# EAGLE design calchack (EAGLE 6.4)
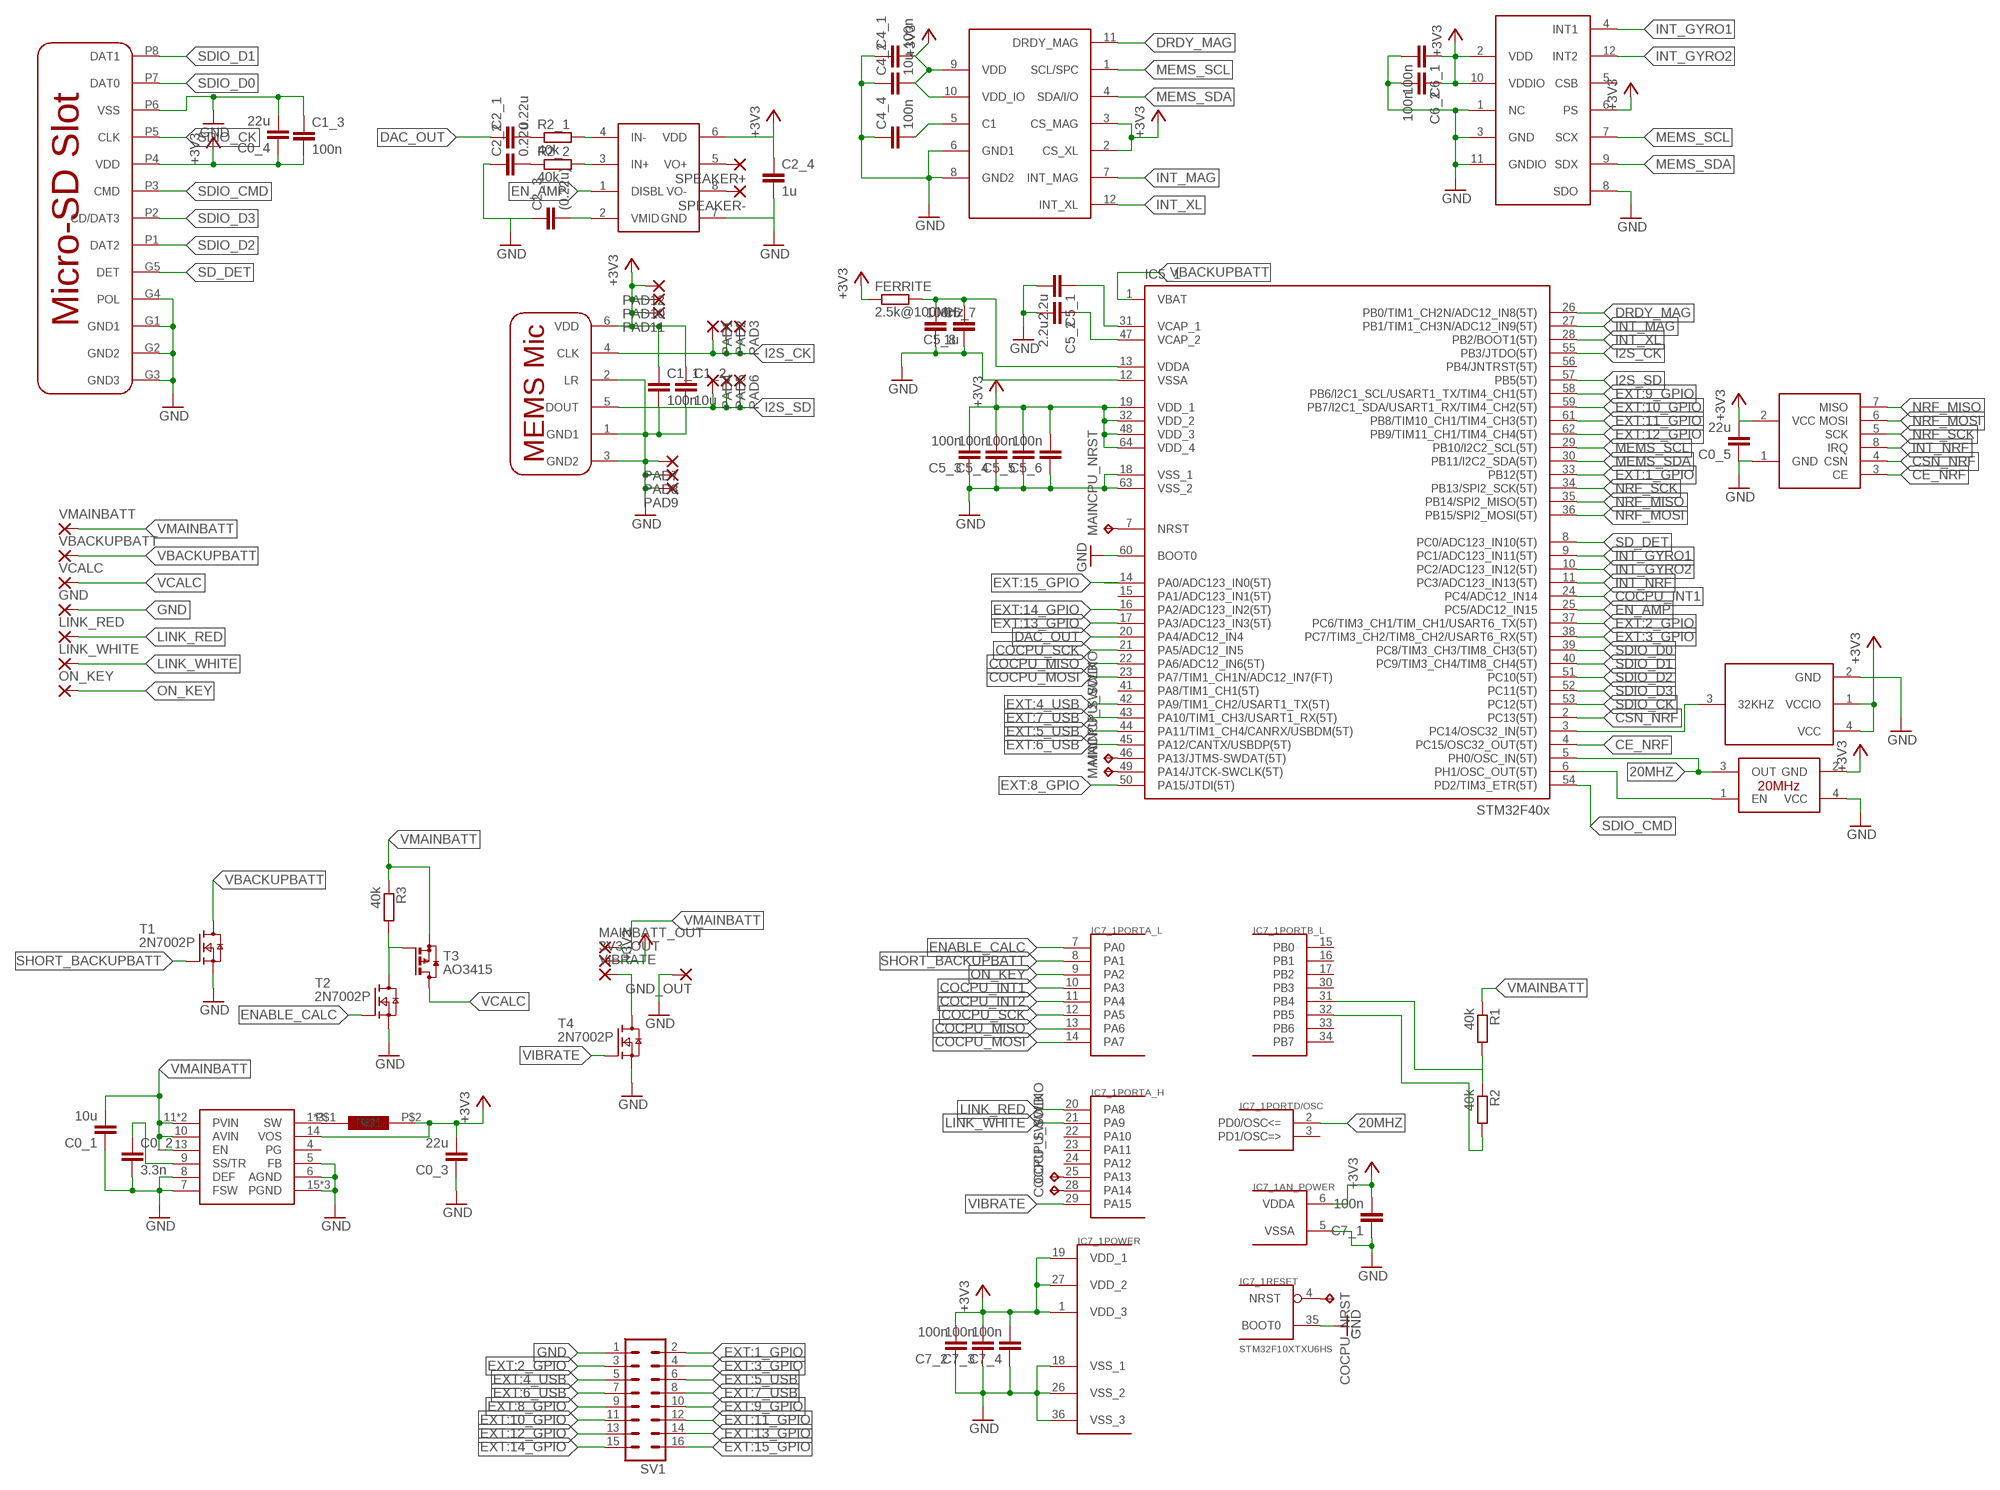
[diagram p0: schematic, sheet 1]

## Parts
3V3_OUT  1,6/0,8  [1,6/0,8]
C0_1  10u  C-EUC0805  [C0805]
C0_2  3.3n  C-EUC0603  [C0603]
C0_3  22u  C-EUC0805  [C0805]
C0_4  22u  C-EUC0805  [C0805]
C0_5  22u  C-EUC0805  [C0805]
C1_1  100n  C-EUC0603  [C0603]
C1_2  10u  C-EUC0603  [C0603]
C1_3  100n  C-EUC0603  [C0603]
C2_1  0.22u  C-EUC0603  [C0603]
C2_2  0.22u  C-EUC0603  [C0603]
C2_3  (0.22u)  C-EUC0603  [C0603]
C2_4  1u  C-EUC0603  [C0603]
C4_1  100n  C-EUC0603  [C0603]
C4_2  10u  C-EUC0603  [C0603]
C4_4  100n  C-EUC0603  [C0603]
C5_1  2.2u  C-EUC0603  [C0603]
C5_2  2.2u  C-EUC0603  [C0603]
C5_3  100n  C-EUC0603  [C0603]
C5_4  100n  C-EUC0603  [C0603]
C5_5  100n  C-EUC0603  [C0603]
C5_6  100n  C-EUC0603  [C0603]
C5_7  1u  C-EUC0603  [C0603]
C5_8  100n  C-EUC0603  [C0603]
C6_1  100n  C-EUC0603  [C0603]
C6_2  100n  C-EUC0603  [C0603]
C7_1  100n  C-EUC0603  [C0603]
C7_2  100n  C-EUC0603  [C0603]
C7_3  100n  C-EUC0603  [C0603]
C7_4  100n  C-EUC0603  [C0603]
COCPU_NRST  TPTP10SQ  [TP10SQ]
COCPU_SWCLK  TPTP10SQ  [TP10SQ]
COCPU_SWDIO  TPTP10SQ  [TP10SQ]
FERRITE  2.5k@100MHz  R-EU_R0603  [R0603]
GND  1,6/0,8  [1,6/0,8]
GND_OUT  1,6/0,8  [1,6/0,8]
IC0_1  TPS62142  [TPS62142]
IC1_1  MP45DT02  [MP45DT02]
IC2_1  TPA6211A1  [TPA6211A1]
IC3_1  475710001  [475710001]
IC4_1  LSM303C  [LSM303C]
IC5_1  STM32F405R  [TQFP64]
IC6_1  BMG160  [BMG160]
IC7_1  STM32F10XTXU6HS  [VFQFPN36-HS]
L0_1  IHLP1212BZER2R2M11  [IHLP1212BZER2R2M11]
LINK_RED  1,6/0,8  [1,6/0,8]
LINK_WHITE  1,6/0,8  [1,6/0,8]
MAINBATT_OUT  1,6/0,8  [1,6/0,8]
MAINCPU_NRST  TPTP10SQ  [TP10SQ]
MAINCPU_SWCLK  TPTP10SQ  [TP10SQ]
MAINCPU_SWDIO  TPTP10SQ  [TP10SQ]
NRF24L01  NRF24L01  [NRF24L01]
ON_KEY  1,6/0,8  [1,6/0,8]
OSC5_1  SG-3030JC  [SG-3030JC]
PAD1  1,6/0,8  [1,6/0,8]
PAD2  1,6/0,8  [1,6/0,8]
PAD3  1,6/0,8  [1,6/0,8]
PAD4  1,6/0,8  [1,6/0,8]
PAD5  1,6/0,8  [1,6/0,8]
PAD6  1,6/0,8  [1,6/0,8]
PAD7  1,6/0,8  [1,6/0,8]
PAD8  1,6/0,8  [1,6/0,8]
PAD9  1,6/0,8  [1,6/0,8]
PAD10  1,6/0,8  [1,6/0,8]
PAD11  1,6/0,8  [1,6/0,8]
PAD12  1,6/0,8  [1,6/0,8]
R1  40k  R-EU_R0603  [R0603]
R2  40k  R-EU_R0603  [R0603]
R2_1  40k  R-EU_R0603  [R0603]
R2_2  40k  R-EU_R0603  [R0603]
R3  40k  R-EU_R0603  [R0603]
SPEAKER+  1,6/0,8  [1,6/0,8]
SPEAKER-  1,6/0,8  [1,6/0,8]
SV1  MA08-2  [MA08-2]
T1  2N7002P  [SOT23]
T2  2N7002P  [SOT23]
T3  AO3415  [AO3415]
T4  2N7002P  [SOT23]
U$1  ASDMB-20.000MHZ-LC-T  [ASDMB-20.000MHZ-LC-T]
VBACKUPBATT  1,6/0,8  [1,6/0,8]
VCALC  1,6/0,8  [1,6/0,8]
VIBRATE  1,6/0,8  [1,6/0,8]
VMAINBATT  1,6/0,8  [1,6/0,8]

## Nets
20MHZ: IC5_1.5(PH0/OSC_IN(5T)) IC7_1.2(PORTD/OSC:PD0/OSC<=) U$1.3(OUT)
+3V3: 3V3_OUT.1(P) C0_3.2 C0_4.1 C0_5.2 C1_1.1 C1_2.1 C1_3.2 C2_4.1 C4_1.2 C4_2.2 C5_3.2 C5_4.2 C5_5.2 C5_6.2 C6_1.1 C6_2.1 C7_1.2 C7_2.2 C7_3.2 C7_4.2 FERRITE.1 IC0_1.14(VOS) IC1_1.6(VDD) IC2_1.6(VDD) IC3_1.P4(VDD) IC4_1.2(CS_XL) IC4_1.3(CS_MAG) IC4_1.9(VDD) IC4_1.10(VDD_IO) IC5_1.19(VDD_1) IC5_1.32(VDD_2) IC5_1.48(VDD_3) IC5_1.64(VDD_4) IC6_1.2(VDD) IC6_1.6(PS) IC6_1.10(VDDIO) IC7_1.1(POWER:VDD_3) IC7_1.6(AN_POWER:VDDA) IC7_1.19(POWER:VDD_1) IC7_1.27(POWER:VDD_2) L0_1.P$2 NRF24L01.2(VCC) OSC5_1.1(VCCIO) OSC5_1.4(VCC) PAD10.1(P) PAD11.1(P) PAD12.1(P) U$1.2(GND)
CE_NRF: IC5_1.4(PC15/OSC32_OUT(5T)) NRF24L01.3(CE)
COCPU_INT1: IC5_1.24(PC4/ADC12_IN14) IC7_1.10(PORTA_L:PA3)
COCPU_INT2: IC7_1.11(PORTA_L:PA4)
COCPU_MISO: IC5_1.22(PA6/ADC12_IN6(5T)) IC7_1.13(PORTA_L:PA6)
COCPU_MOSI: IC5_1.23(PA7/TIM1_CH1N/ADC12_IN7(FT)) IC7_1.14(PORTA_L:PA7)
COCPU_SCK: IC5_1.21(PA5/ADC12_IN5) IC7_1.12(PORTA_L:PA5)
CSN_NRF: IC5_1.2(PC13(5T)) NRF24L01.4(CSN)
DAC_OUT: C2_1.1 IC5_1.20(PA4/ADC12_IN4)
DRDY_MAG: IC4_1.11(DRDY_MAG) IC5_1.26(PB0/TIM1_CH2N/ADC12_IN8(5T))
EN_AMP: IC2_1.1(DISBL) IC5_1.25(PC5/ADC12_IN15)
ENABLE_CALC: IC7_1.7(PORTA_L:PA0) T2.1(G)
EXT:1_GPIO: IC5_1.33(PB12(5T)) SV1.2
EXT:2_GPIO: IC5_1.37(PC6/TIM3_CH1/TIM_CH1/USART6_TX(5T)) SV1.3
EXT:3_GPIO: IC5_1.38(PC7/TIM3_CH2/TIM8_CH2/USART6_RX(5T)) SV1.4
EXT:4_USB: IC5_1.42(PA9/TIM1_CH2/USART1_TX(5T)) SV1.5
EXT:5_USB: IC5_1.44(PA11/TIM1_CH4/CANRX/USBDM(5T)) SV1.6
EXT:6_USB: IC5_1.45(PA12/CANTX/USBDP(5T)) SV1.7
EXT:7_USB: IC5_1.43(PA10/TIM1_CH3/USART1_RX(5T)) SV1.8
EXT:8_GPIO: IC5_1.50(PA15/JTDI(5T)) SV1.9
EXT:9_GPIO: IC5_1.58(PB6/I2C1_SCL/USART1_TX/TIM4_CH1(5T)) SV1.10
EXT:10_GPIO: IC5_1.59(PB7/I2C1_SDA/USART1_RX/TIM4_CH2(5T)) SV1.11
EXT:11_GPIO: IC5_1.61(PB8/TIM10_CH1/TIM4_CH3(5T)) SV1.12
EXT:12_GPIO: IC5_1.62(PB9/TIM11_CH1/TIM4_CH4(5T)) SV1.13
EXT:13_GPIO: IC5_1.17(PA3/ADC123_IN3(5T)) SV1.14
EXT:14_GPIO: IC5_1.16(PA2/ADC123_IN2(5T)) SV1.15
EXT:15_GPIO: IC5_1.14(PA0/ADC123_IN0(5T)) SV1.16
GND: C0_1.1 C0_2.2 C0_3.1 C0_4.2 C0_5.1 C1_1.2 C1_2.2 C1_3.1 C2_2.1 C2_3.1 C2_4.2 C4_1.1 C4_2.1 C4_4.1 C5_1.2 C5_2.2 C5_3.1 C5_4.1 C5_5.1 C5_6.1 C5_7.2 C5_8.1 C6_1.2 C6_2.2 C7_1.1 C7_2.1 C7_3.1 C7_4.1 GND.1(P) GND_OUT.1(P) IC0_1.5(FB) IC0_1.6(AGND) IC0_1.7(FSW) IC0_1.8(DEF) IC0_1.15(PGND) IC0_1.16(PGND) IC0_1.TH(PGND) IC1_1.1(GND1) IC1_1.2(LR) IC1_1.3(GND2) IC2_1.7(GND) IC3_1.G1(GND1) IC3_1.G2(GND2) IC3_1.G3(GND3) IC3_1.G4(POL) IC3_1.P6(VSS) IC4_1.6(GND1) IC4_1.8(GND2) IC5_1.12(VSSA) IC5_1.18(VSS_1) IC5_1.60(BOOT0) IC5_1.63(VSS_2) IC6_1.1(NC) IC6_1.3(GND) IC6_1.8(SDO) IC6_1.11(GNDIO) IC7_1.5(AN_POWER:VSSA) IC7_1.18(POWER:VSS_1) IC7_1.26(POWER:VSS_2) IC7_1.35(RESET:BOOT0) IC7_1.36(POWER:VSS_3) NRF24L01.1(GND) OSC5_1.2(GND) PAD7.1(P) PAD8.1(P) PAD9.1(P) SV1.1 T1.2(S) T2.2(S) T4.2(S) U$1.4(VCC)
I2S_CK: IC1_1.4(CLK) IC5_1.55(PB3/JTDO(5T)) PAD1.1(P) PAD2.1(P) PAD3.1(P)
I2S_SD: IC1_1.5(DOUT) IC5_1.57(PB5(5T)) PAD4.1(P) PAD5.1(P) PAD6.1(P)
INT_GYRO1: IC5_1.9(PC1/ADC123_IN11(5T)) IC6_1.4(INT1)
INT_GYRO2: IC5_1.10(PC2/ADC123_IN12(5T)) IC6_1.12(INT2)
INT_MAG: IC4_1.7(INT_MAG) IC5_1.27(PB1/TIM1_CH3N/ADC12_IN9(5T))
INT_NRF: IC5_1.11(PC3/ADC123_IN13(5T)) NRF24L01.8(IRQ)
INT_XL: IC4_1.12(INT_XL) IC5_1.28(PB2/BOOT1(5T))
LINK_RED: IC7_1.20(PORTA_H:PA8) LINK_RED.1(P)
LINK_WHITE: IC7_1.21(PORTA_H:PA9) LINK_WHITE.1(P)
MEMS_SCL: IC4_1.1(SCL/SPC) IC5_1.29(PB10/I2C2_SCL(5T)) IC6_1.7(SCX)
MEMS_SDA: IC4_1.4(SDA/I/O) IC5_1.30(PB11/I2C2_SDA(5T)) IC6_1.9(SDX)
N$1: IC2_1.3(IN+) R2_2.2
N$2: IC2_1.4(IN-) R2_1.2
N$3: C2_1.2 R2_1.1
N$4: C2_2.2 R2_2.1
N$5: C2_3.2 IC2_1.2(VMID)
N$6: IC5_1.6(PH1/OSC_OUT(5T)) U$1.1(EN)
N$7: C4_4.2 IC4_1.5(C1)
N$8: C5_7.1 C5_8.2 FERRITE.2 IC5_1.13(VDDA)
N$9: COCPU_SWDIO.TP IC7_1.25(PORTA_H:PA13)
N$10: C0_2.1 IC0_1.9(SS/TR)
N$11: IC2_1.5(VO+) SPEAKER+.1(P)
N$12: C5_2.1 IC5_1.47(VCAP_2)
N$13: C5_1.1 IC5_1.31(VCAP_1)
N$14: IC2_1.8(VO-) SPEAKER-.1(P)
N$15: IC0_1.1(SW) IC0_1.2(SW) IC0_1.3(SW) L0_1.P$1
N$16: R3.2 T2.3(D) T3.1(G)
N$17: COCPU_NRST.TP IC7_1.4(RESET:NRST)
N$18: T4.3(D) VIBRATE.1(P)
N$19: COCPU_SWCLK.TP IC7_1.28(PORTA_H:PA14)
N$20: IC5_1.49(PA14/JTCK-SWCLK(5T)) MAINCPU_SWCLK.TP
N$21: IC5_1.46(PA13/JTMS-SWDAT(5T)) MAINCPU_SWDIO.TP
N$22: IC5_1.3(PC14/OSC32_IN(5T)) OSC5_1.3(32KHZ)
N$23: IC5_1.7(NRST) MAINCPU_NRST.TP
N$24: IC7_1.31(PORTB_L:PB4) R1.2 R2.1
N$25: IC7_1.32(PORTB_L:PB5) R2.2
NRF_MISO: IC5_1.35(PB14/SPI2_MISO(5T)) NRF24L01.7(MISO)
NRF_MOSI: IC5_1.36(PB15/SPI2_MOSI(5T)) NRF24L01.6(MOSI)
NRF_SCK: IC5_1.34(PB13/SPI2_SCK(5T)) NRF24L01.5(SCK)
ON_KEY: IC7_1.9(PORTA_L:PA2) ON_KEY.1(P)
SD_DET: IC3_1.G5(DET) IC5_1.8(PC0/ADC123_IN10(5T))
SDIO_CK: IC3_1.P5(CLK) IC5_1.53(PC12(5T))
SDIO_CMD: IC3_1.P3(CMD) IC5_1.54(PD2/TIM3_ETR(5T))
SDIO_D0: IC3_1.P7(DAT0) IC5_1.39(PC8/TIM3_CH3/TIM8_CH3(5T))
SDIO_D1: IC3_1.P8(DAT1) IC5_1.40(PC9/TIM3_CH4/TIM8_CH4(5T))
SDIO_D2: IC3_1.P1(DAT2) IC5_1.51(PC10(5T))
SDIO_D3: IC3_1.P2(CD/DAT3) IC5_1.52(PC11(5T))
SHORT_BACKUPBATT: IC7_1.8(PORTA_L:PA1) T1.1(G)
VBACKUPBATT: IC5_1.1(VBAT) T1.3(D) VBACKUPBATT.1(P)
VCALC: T3.3(D) VCALC.1(P)
VIBRATE: IC7_1.29(PORTA_H:PA15) T4.1(G)
VMAINBATT: C0_1.2 IC0_1.10(AVIN) IC0_1.11(PVIN) IC0_1.12(PVIN) IC0_1.13(EN) MAINBATT_OUT.1(P) R1.1 R3.1 T3.2(S) VMAINBATT.1(P)
Unconnected: IC0_1.4(PG) IC5_1.15(PA1/ADC123_IN1(5T)) IC5_1.41(PA8/TIM1_CH1(5T)) IC5_1.56(PB4/JNTRST(5T)) IC6_1.5(CSB) IC7_1.3(PORTD/OSC:PD1/OSC=>) IC7_1.15(PORTB_L:PB0) IC7_1.16(PORTB_L:PB1) IC7_1.17(PORTB_L:PB2) IC7_1.22(PORTA_H:PA10) IC7_1.23(PORTA_H:PA11) IC7_1.24(PORTA_H:PA12) IC7_1.30(PORTB_L:PB3) IC7_1.33(PORTB_L:PB6) IC7_1.34(PORTB_L:PB7)

## Library data of the parts
3V3_OUT GND GND_OUT LINK_RED LINK_WHITE MAINBATT_OUT ON_KEY PAD1-PAD12 SPEAKER+ SPEAKER- VBACKUPBATT VCALC VIBRATE VMAINBATT = wirepad:1,6/0,8: THROUGH-HOLE PAD
C0_1-C0_5 C1_1-C1_3 C2_1-C2_4 C4_1 C4_2 C4_4 C5_1-C5_8 C6_1 C6_2 C7_1-C7_4 = rcl:C-EU: CAPACITOR, European symbol
COCPU_NRST COCPU_SWCLK COCPU_SWDIO MAINCPU_NRST MAINCPU_SWCLK MAINCPU_SWDIO = testpad:TP: Test pad
FERRITE R1 R2 R2_1 R2_2 R3 = rcl:R-EU_: RESISTOR, European symbol
IC0_1 = calchack:TPS62142
IC1_1 = calchack:MP45DT02
IC2_1 = calchack:TPA6211A1
IC3_1 = calchack:475710001
IC4_1 = calchack:LSM303C
IC5_1 = stm32f4:STM32F405R: STM32F405 64 pin LQFP reviewed: YES tested: YES
IC6_1 = calchack:BMG160
IC7_1 = stm32:STM32F10XTXU6: STM32F101/103 36pad VFQPFN36
L0_1 = calchack:IHLP1212BZER2R2M11
NRF24L01 = calchack:NRF24L01
OSC5_1 = calchack:SG-3030JC
SV1 = con-lstb:MA08-2: PIN HEADER; OC_FARNELL: unknown; OC_NEWARK: unknown
T1 T2 T4 = nxp:2N7002: N-channel TrenchMOS FET N-channel enhancement mode Field-Effect Transistor (FET) in a plastic package using TrenchMOS technology. AAL Eindhoven MK
T3 = calchack:AO3415: P-CHANNEL MOS FET
U$1 = calchack:ASDMB-20.000MHZ-LC-T

## Board
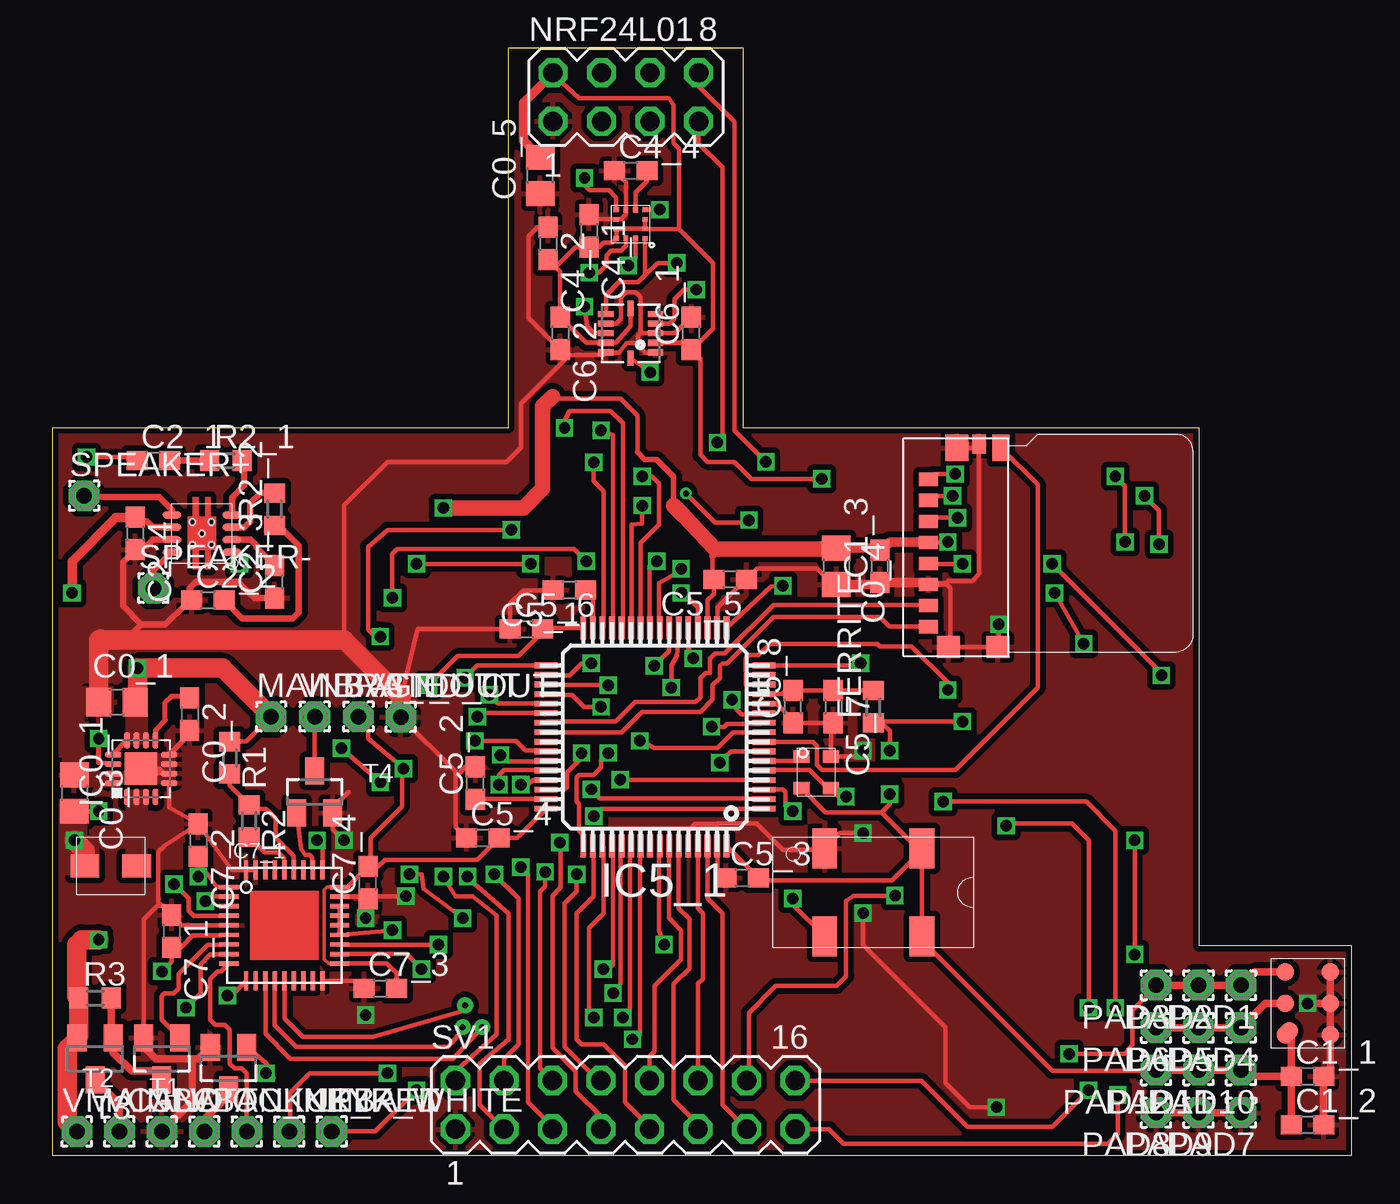
[diagram p1: board, top side]
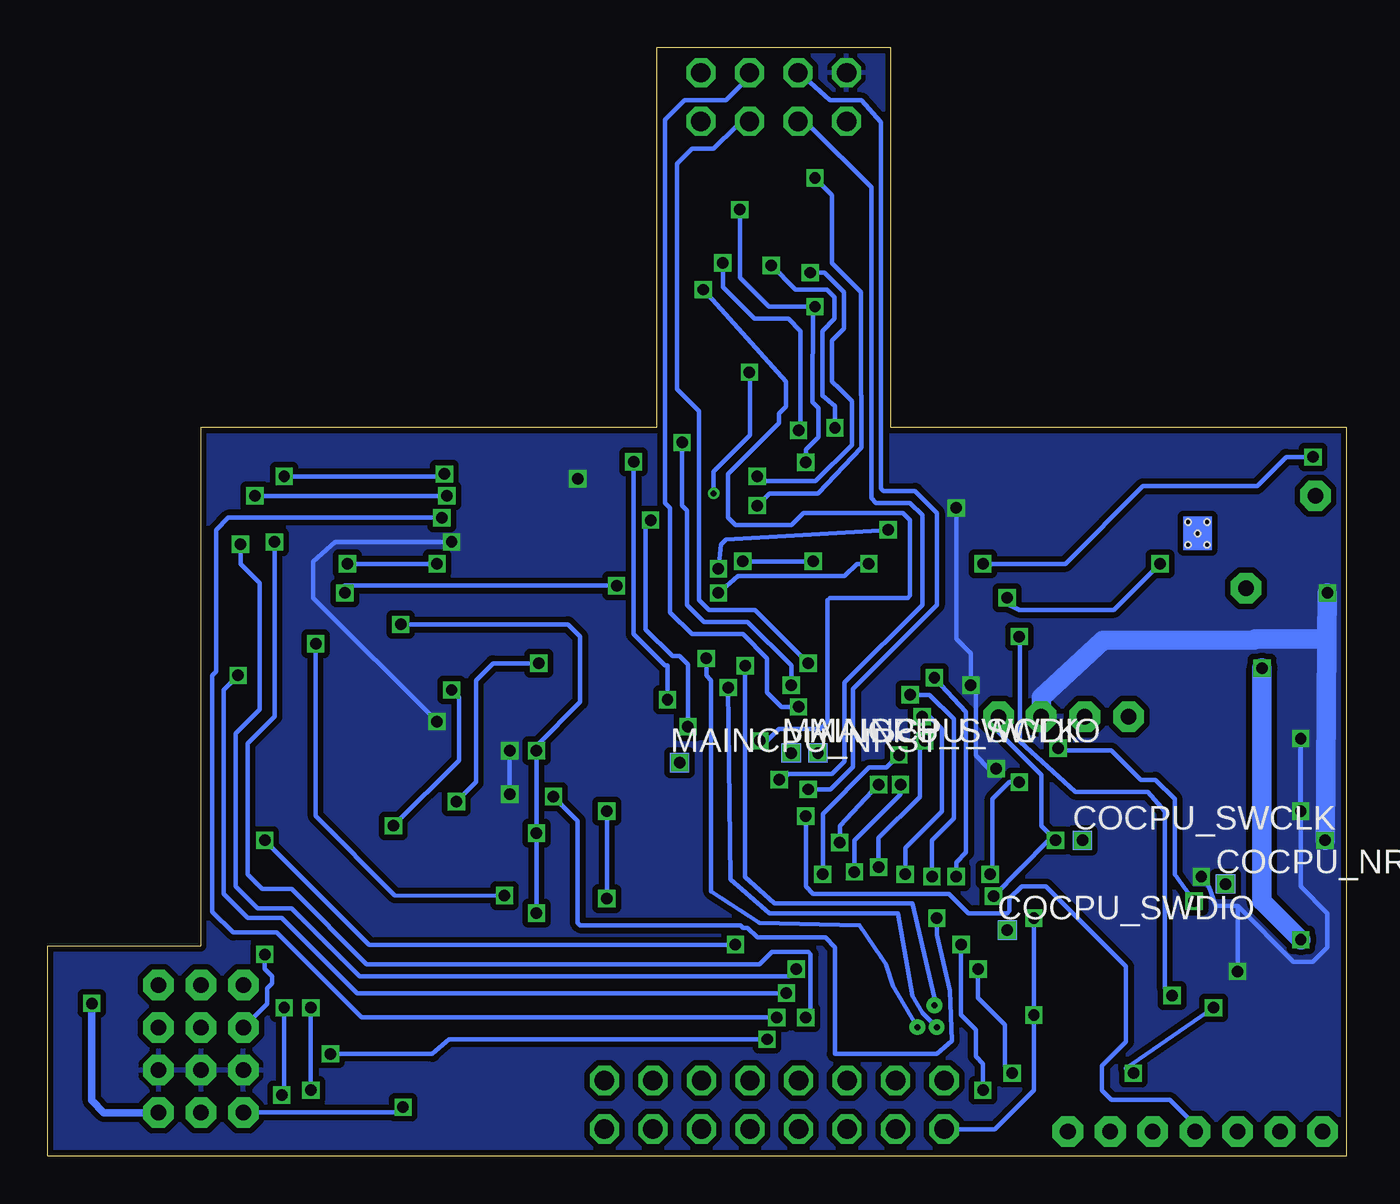
[diagram p2: board, bottom side, seen from below]

Size 68 x 58 mm. Coordinates in mm from the lower left corner, seen from the top.
Outline: 68,0 0,0 0,38.13 23.87,38.13 23.87,58 36.13,58 36.13,38.13 60,38.13 60,11 68,11 68,0
Copper layers (1*16): Top 0.035mm / dielectric 1.5mm / Bottom 0.035mm
Design rules "Elecrow_2-layer_eagle_rule": minimum track width 6mil, minimum drill 12mil, track to track 6mil, track to pad 6mil, pad to pad 6mil, via to via 6mil, smd to smd 0mil, copper to edge 10mil, drill to drill 10mil, minimum pad ring 10mil, minimum via ring 6mil, stop-mask expansion 2mil, vias tented up to drill 100mil, thermal gap 10mil

### Footprints (pad centres in the part's own frame; a part is rotated, then mirrored left to right if it is on the bottom)
1,6/0,8 = drill 0.813 pad 1.6 octagon: 1 0,0
C0805 = smd 1.3 x 1.5: 1 -0.95,0; 2 0.95,0
C0603 = smd 1.1 x 1: 1 -0.85,0; 2 0.85,0
TP10SQ = smd 1 x 1: TP 0,0
R0603 = smd 1 x 1.1: 1 -0.85,0; 2 0.85,0
TPS62142 = smd 0.85 x 0.3: 1 -1.475,0.75; 2 -1.475,0.25; 3 -1.475,-0.25; 4 -1.475,-0.75; 9 1.475,-0.75; 10 1.475,-0.25; 11 1.475,0.25; 12 1.475,0.75 | smd 0.3 x 0.85: 5 -0.75,-1.475; 6 -0.25,-1.475; 7 0.25,-1.475; 8 0.75,-1.475; 13 0.75,1.475; 14 0.25,1.475; 15 -0.25,1.475; 16 -0.75,1.475 | smd 1.7 x 1.7: TH 0,0
MP45DT02 = smd 0.91 x 0.91: 1 -1.175,1.65; 2 -1.175,0; 3 -1.175,-1.65; 4 1.175,-1.65; 5 1.175,0 | smd 0.91 x 1.2 rotated 135: 6 1.075,1.55
TPA6211A1 = smd 0.37 x 1: 1 -0.975,-1.575; 2 -0.325,-1.575; 3 0.325,-1.575; 4 0.975,-1.575; 5 0.975,1.575; 6 0.325,1.575; 7 -0.325,1.575; 8 -0.975,1.575 | hole 0.3: 0,0; -0.6,0.5; -0.6,-0.5; 0.6,-0.5; 0.6,0.5
475710001 = smd 1.15 x 1.2: G1 -4.92,-2.35; G2 -4.92,-4.95 | smd 1.4 x 1.2: G3 5.5,-2.8 | smd 1 x 0.7: G4 5.7,-3.95 | smd 1.4 x 0.9: G5 5.5,-5.1 | smd 0.7 x 1: P1 3.85,-1.3; P2 2.75,-1.3; P3 1.65,-1.3; P4 0.55,-1.3; P5 -0.55,-1.3; P6 -1.65,-1.3; P7 -2.75,-1.3; P8 -3.85,-1.3
LSM303C = smd 0.275 x 0.25: 1 -0.75,0.75; 2 -0.75,0.25; 3 -0.75,-0.25; 4 -0.75,-0.75; 7 0.75,-0.75; 8 0.75,-0.25; 9 0.75,0.25; 10 0.75,0.75 | smd 0.25 x 0.275: 5 -0.25,-0.75; 6 0.25,-0.75; 11 0.25,0.75; 12 -0.25,0.75
TQFP64 = smd 1.2 x 0.3: 1 -5.7,3.75; 2 -5.7,3.25; 3 -5.7,2.75; 4 -5.7,2.25; 5 -5.7,1.75; 6 -5.7,1.25; 7 -5.7,0.75; 8 -5.7,0.25; 9 -5.7,-0.25; 10 -5.7,-0.75; 11 -5.7,-1.25; 12 -5.7,-1.75; 13 -5.7,-2.25; 14 -5.7,-2.75; 15 -5.7,-3.25; 16 -5.7,-3.75; 33 5.7,-3.75; 34 5.7,-3.25; 35 5.7,-2.75; 36 5.7,-2.25; 37 5.7,-1.75; 38 5.7,-1.25; 39 5.7,-0.75; 40 5.7,-0.25; 41 5.7,0.25; 42 5.7,0.75; 43 5.7,1.25; 44 5.7,1.75; 45 5.7,2.25; 46 5.7,2.75; 47 5.7,3.25; 48 5.7,3.75 | smd 0.3 x 1.2: 17 -3.75,-5.7; 18 -3.25,-5.7; 19 -2.75,-5.7; 20 -2.25,-5.7; 21 -1.75,-5.7; 22 -1.25,-5.7; 23 -0.75,-5.7; 24 -0.25,-5.7; 25 0.25,-5.7; 26 0.75,-5.7; 27 1.25,-5.7; 28 1.75,-5.7; 29 2.25,-5.7; 30 2.75,-5.7; 31 3.25,-5.7; 32 3.75,-5.7; 49 3.75,5.7; 50 3.25,5.7; 51 2.75,5.7; 52 2.25,5.7; 53 1.75,5.7; 54 1.25,5.7; 55 0.75,5.7; 56 0.25,5.7; 57 -0.25,5.7; 58 -0.75,5.7; 59 -1.25,5.7; 60 -1.75,5.7; 61 -2.25,5.7; 62 -2.75,5.7; 63 -3.25,5.7; 64 -3.75,5.7
BMG160 = smd 0.8 x 0.32: 1 -1.3,1; 2 -1.3,0.5; 3 -1.3,0; 4 -1.3,-0.5; 5 -1.3,-1; 7 1.3,-1; 8 1.3,-0.5; 9 1.3,0; 10 1.3,0.5; 11 1.3,1 | smd 0.32 x 0.8: 6 0,-1.3; 12 0,1.3
VFQFPN36-HS = smd 1 x 0.23: 1 -2.9,2; 2 -2.9,1.5; 3 -2.9,1; 4 -2.9,0.5; 5 -2.9,0; 6 -2.9,-0.5; 7 -2.9,-1; 8 -2.9,-1.5; 9 -2.9,-2; 19 2.9,-2; 20 2.9,-1.5; 21 2.9,-1; 22 2.9,-0.5; 23 2.9,0; 24 2.9,0.5; 25 2.9,1; 26 2.9,1.5; 27 2.9,2 | smd 0.23 x 1: 10 -2,-2.9; 11 -1.5,-2.9; 12 -1,-2.9; 13 -0.5,-2.9; 14 0,-2.9; 15 0.5,-2.9; 16 1,-2.9; 17 1.5,-2.9; 18 2,-2.9; 28 2,2.9; 29 1.5,2.9; 30 1,2.9; 31 0.5,2.9; 32 0,2.9; 33 -0.5,2.9; 34 -1,2.9; 35 -1.5,2.9; 36 -2,2.905
IHLP1212BZER2R2M11 = smd 1.5 x 1.2: P$1 1.35,0; P$2 -1.35,0
NRF24L01 = drill 1.016 octagon: 1 -3.81,-1.27; 2 -3.81,1.27; 3 -1.27,-1.27; 4 -1.27,1.27; 5 1.27,-1.27; 6 1.27,1.27; 7 3.81,-1.27; 8 3.81,1.27
SG-3030JC = smd 1.3 x 2.1: 1 -2.54,-2.3; 2 2.54,-2.3; 3 2.54,2.3; 4 -2.54,2.3
MA08-2 = drill 1.016 octagon: 1 -8.89,-1.27; 2 -8.89,1.27; 3 -6.35,-1.27; 4 -6.35,1.27; 5 -3.81,-1.27; 6 -3.81,1.27; 7 -1.27,-1.27; 8 -1.27,1.27; 9 1.27,-1.27; 10 1.27,1.27; 11 3.81,-1.27; 12 3.81,1.27; 13 6.35,-1.27; 14 6.35,1.27; 15 8.89,-1.27; 16 8.89,1.27
SOT23 = smd 1 x 1.4: 1 -0.95,-1.1; 2 0.95,-1.1; 3 0,1.1
AO3415 = smd 1 x 1.4: 1 -0.95,-1.1; 2 0.95,-1.1; 3 0,1.1
ASDMB-20.000MHZ-LC-T = smd 0.65 x 0.85: 1 -0.825,-0.775; 2 0.825,-0.775; 3 0.825,0.775; 4 -0.825,0.775

### Placement (x,y rotation side)
3V3_OUT  16,22.99 0 top
C0_1  3.37,23.75 0 top
C0_2  7.18,23.11 270 top
C0_3  1.14,18.99 270 top
C0_4  41.02,30.86 270 top
C0_5  25.53,51.31 90 top
C1_1  65.7,4.17 0 top
C1_2  65.7,1.63 0 top
C1_3  43.31,30.86 90 top
C2_1  5.27,36.39 0 top
C2_2  8.13,29.08 0 top
C2_3  11.62,30.04 90 top
C2_4  4.32,32.58 270 top
C4_1  28.07,48.41 270 top
C4_2  25.94,47.75 270 top
C4_4  30.26,51.56 0 top
C5_1  27.05,29.61 180 top
C5_2  22.13,19.5 90 top
C5_3  36.1,14.55 0 top
C5_4  22.51,16.65 0 top
C5_5  35.46,30.17 180 top
C5_6  24.79,27.57 0 top
C5_7  40.86,23.5 270 top
C5_8  38.76,23.5 90 top
C6_1  33.43,43.05 90 top
C6_2  26.57,43.05 270 top
C7_1  6.22,11.75 270 top
C7_2  7.62,16.51 270 top
C7_3  17.14,8.76 0 top
C7_4  16.51,14.29 90 top
COCPU_NRST  6.35,14.22 0 bottom
COCPU_SWCLK  13.84,16.51 0 bottom
COCPU_SWDIO  17.78,11.81 0 bottom
FERRITE  42.96,23.5 90 top
GND  5.71,1.27 0 top
GND_OUT  18.22,22.97 0 top
IC0_1  4.64,20.26 90 top
IC1_1  65.7,7.98 180 top
IC2_1  7.81,32.58 90 top
IC3_1  44.54,31.55 90 top
IC4_1  30.26,48.77 180 top
IC5_1  31.53,21.92 180 top
IC6_1  30.26,43.05 180 top
IC7_1  12.13,12.06 0 top
L0_1  3.05,15.18 0 top
LINK_RED  12.38,1.27 0 top
LINK_WHITE  14.61,1.27 0 top
MAINBATT_OUT  11.43,22.99 0 top
MAINCPU_NRST  34.92,20.57 0 bottom
MAINCPU_SWCLK  29.08,21.08 0 bottom
MAINCPU_SWDIO  27.69,21.08 0 bottom
NRF24L01  30,55.42 0 top
ON_KEY  10.16,1.27 0 top
OSC5_1  42.96,13.79 180 top
PAD1  62.2,8.93 180 top
PAD2  59.98,8.93 180 top
PAD3  57.76,8.93 180 top
PAD4  62.2,6.71 180 top
PAD5  59.98,6.71 180 top
PAD6  57.76,6.71 180 top
PAD7  62.2,2.26 180 top
PAD8  57.76,2.26 180 top
PAD9  59.98,2.26 180 top
PAD10  62.2,4.48 180 top
PAD11  59.98,4.48 180 top
PAD12  57.76,4.48 180 top
R1  9.27,20.83 270 top
R2  10.29,17.53 270 top
R2_1  9.08,36.39 0 top
R2_2  11.62,33.85 90 top
R3  2.22,8.26 0 top
SPEAKER+  1.65,34.54 0 top
SPEAKER-  5.27,29.72 0 top
SV1  29.97,2.67 0 top
T1  9.21,4.57 180 top
T2  5.71,5.08 180 top
T3  2.22,5.08 180 top
T4  13.72,19.05 0 top
U$1  39.97,20.08 270 top
VBACKUPBATT  7.94,1.27 0 top
VCALC  3.49,1.27 0 top
VIBRATE  13.72,22.99 0 top
VMAINBATT  1.27,1.27 0 top

### Tracks (layer width: path | path; a pad name or v marks a point on that pad's centre or on a via)
20MHZ  (via drill 0.6)
  Top 0.229: IC7_1.2 8.82,13.59 8,13.59 7.75,13.34 v8,13.34 | 40.57,19.25 39.62,20.19 37.25,20.19 IC5_1.5 | 40.57,19.25 U$1.3 | 40.57,19.25 40.64,19.18 40.77,19.18 41.15,18.8 v41.53,18.8 | v21.46,12.45 19.43,13.97 19.3,14.73 v18.67,14.73 | v17.14,19.56 v15.11,21.34
  Bottom 0.229: v8,13.34 9.02,14.73 9.02,18.67 10.03,19.68 10.79,19.68 12.32,21.21 14.86,21.21 v15.11,21.34 | v41.53,18.8 40.26,17.53 40.26,12.19 40.13,12.06 31.75,12.06 31.62,11.94 31.37,11.94 30.86,11.43 27.3,11.43 26.8,10.92 26.8,5.33 21.46,5.33 20.68,6.02 20.78,8.64 21.46,11.56 v21.46,12.45 | v18.67,14.73 18.54,14.86 18.54,18.67 17.65,19.56 v17.14,19.56
+3V3  (via drill 0.6)
  Top 0.178: IC7_1.27 15.02,14.07 14.38,14.07 14.22,13.92 14.22,10.29 14.45,10.06 IC7_1.19
  Top 0.229: 7.62,15.41 8.58,14.06 IC7_1.1 | C7_4.2 15.44,14.06 IC7_1.27 | IC7_1.6 8.81,11.53 7.34,11.53 6.73,10.92 6.25,10.92 C7_1.2 6.22,10.16 v5.71,9.65 | C7_2.2 7.62,15.41 | 7.62,15.41 v7.62,14.61 | 30.26,44.58 IC6_1.6 30.26,43.43 29.5,42.55 IC6_1.10 27.92,42.55 C6_2.1 26.57,46.32 26.52,46.32 26.32,46.52 | IC4_1.3 IC4_1.2 | IC4_1.2 IC4_1.9 IC4_1.10 29.29,47.8 28.83,47.8 28.59,47.56 C4_1.2 | C4_1.2 28.05,47.79 | 3V3_OUT.1 16.51,22.35 16.51,21.84 18.16,20.45 v18.35,20.26 18.29,20.07 18.29,18.29 16.64,16.64 16.64,15.26 C7_4.2 | 33.81,42.55 IC6_1.2 33.08,42.55 C6_1.1 33.91,41.73 33.91,36.7 34.29,36.32 35.69,36.32 36.58,35.43 v40.26,35.43 | 33.81,42.55 34.57,43.31 34.57,46.74 32.8,48.51 | IC4_1.2 32.8,48.51 | 33.81,42.55 33.56,42.29 33.43,42.29 33.05,41.91 | IC5_1.64 C5_3.2 37.07,14.43 43.94,14.43 45.49,15.98 OSC5_1.1 | IC5_1.48 24.3,16.65 C5_4.2 22.21,15.49 17.4,15.49 17.04,15.14 C7_4.2 | C5_6.2 25.85,27.62 | 25.85,27.62 IC5_1.32 | U$1.2 40.46,17.98 43.38,17.98 | 43.38,17.98 45.28,16.09 OSC5_1.1 | OSC5_1.1 OSC5_1.4 45.49,11.27 52.32,4.45 57.72,4.45 PAD12.1 | 32.8,48.51 32.8,52.73 32.51,53.01 32.51,54.99 32.26,55.37 27.56,55.37 26.37,56.44 NRF24L01.2 | 43.38,17.98 43.81,18.41 v43.81,18.92 | v43.81,21.21 43.81,22.23 43.39,22.65 FERRITE.1 43.03,22.73 v47.62,22.73 | v46.86,32.13 46.83,32.1 IC3_1.P4 | IC5_1.19 34.29,29.08 34.61,29.41 C5_5.2 34.54,30.24 34.54,31.37 | 25.85,27.62 24.39,26.16 21.21,26.16 v19.68,24.64 | C4_2.2 26.32,46.52 | C4_1.2 27.37,47.56 26.32,46.52 | 26.16,39.75 26.29,39.62 29.72,39.62 30.61,38.73 30.61,36.83 | C7_3.2 18,9.56 17.78,9.78 17.53,10.03 17.49,10.06 IC7_1.19
  Top 0.254: C0_3.2 v2.41,18.04 v2.41,18.03 | IC0_1.14 2.41,20.57 v2.41,21.84
  Top 0.3: 30.61,36.83 30.99,36.45 31.62,36.45 32.51,35.56 32.51,34.04
  Top 0.33: IC2_1.6 5.26,32.9 4.95,33.21 4.53,33.21 C2_4.1 | C0_4.1 40.58,31.75 | 34.54,31.37 34.67,31.75
  Top 0.381: C1_2.1 C1_1.1 | C1_1.1 64.85,6.2 IC1_1.6 | C1_1.1 62.84,4.17 | 62.84,4.17 62.52,4.17 PAD10.1 | 62.84,4.17 62.52,4.48 PAD11.1 PAD12.1
  Top 0.508: 4.53,33.21 4.34,33.4 3.3,33.4 1.02,31.11 v1.02,29.46 | IC3_1.P4 45.81,32.13 43.81,32.13 43.4,31.71 C1_3.2 43.21,31.81 C0_4.1 | C0_5.2 24.64,53.15 24.64,55.12 26.19,56.67 NRF24L01.2
  Top 0.813: 40.58,31.75 34.67,31.75 33.05,33.5 32.51,34.04 | 26.16,39.75 25.65,39.24 25.65,34.92 24.64,33.91 v20.45,33.91
  Top 1.016: v1.14,16.51 1.7,15.96 L0_1.P$2
  Bottom 0.229: 5.71,13.08 v5.71,9.65 | 5.71,13.08 2.79,10.16 1.78,10.16 1.02,10.92 1.02,12.7 2.41,14.1 v2.41,18.03 | v43.81,18.92 v43.81,21.21 | v47.62,22.73 54.1,29.21 54.1,31.11 52.96,32.13 v46.86,32.13 | v18.35,20.26 18.73,20.26 19.43,20.95 19.43,24.38 v19.68,24.64 19.68,26.29 20.45,27.05 v20.45,33.91 | 5.71,13.08 6.86,13.08 7.24,14.1 v7.62,14.61
  Bottom 0.254: v2.41,18.03 v2.41,21.84
  Bottom 1.016: v1.02,29.46 1.04,27.05 | 1.04,27.05 v1.14,16.51 | 3V3_OUT.1 16,24 12.78,26.98 4.85,27 4.8,27.05 1.04,27.05
  pour Top (no thermals): 1.78,18.67 1.78,16.76 2.41,16.76 2.41,14.7 0.35,14.7 0.35,18.67
  pour Bottom (isolate 0.305): 0.13,0.38 0.13,38.51 24,38.51 24,58.37 36.25,58.37 36.25,38.53 60.12,38.53 60.12,11.35 68.07,11.35 68.07,10.67 68.1,10.67 68.1,0.38
CE_NRF  (via drill 0.6)
  Top 0.229: IC5_1.4 37.21,19.68 v29.72,19.68
  Bottom 0.229: v29.72,19.68 29.54,19.68 29.23,19.99 26.95,19.99 26.29,20.65 26.29,24.77 22.23,28.83 22.23,33.53 22.86,34.16 24.64,34.16 24.89,34.42 24.89,50.7 28.1,53.9 NRF24L01.3
COCPU_INT1  (via drill 0.6)
  Top 0.229: IC7_1.10 9.53,8.56 v9.14,8.38 | v24,32.77 17.53,32.77 16.51,31.88 16.51,27.56 16.89,27.18 v17.14,27.18 17.14,27.56 | IC5_1.24 31.75,27.64 31.75,29.97 32.38,30.35 v32.89,30.73
  Bottom 0.229: v9.14,8.38 9.53,8.76 9.53,18.03 10.41,19.05 14.22,19.05 17.12,21.69 17.12,27.15 v17.14,27.18 | v24,32.77 32.51,32.26 32.77,32 v32.89,30.73
COCPU_MISO  (via drill 0.3 pad 0.81, 0.6)
  Top 0.229: IC7_1.13 11.63,6.83 12.75,5.71 20.7,5.71 21.59,6.73 v21.46,6.73 | v32.38,24.51 32.38,25.65 32.69,26.19 32.77,27.05 32.78,27.06 IC5_1.22
  Bottom 0.229: v21.46,6.73 22.23,7.49 22.73,8.38 23.5,12.7 30.23,12.7 32.26,14.48 v32.38,24.51
COCPU_MOSI  (via drill 0.3 pad 0.81, 0.6)
  Top 0.229: IC7_1.14 12.14,7.16 13.08,6.22 16.76,6.22 21.59,7.62 v21.59,7.87 | v31.5,25.65 32.26,26.42 32.26,26.67 32.28,26.94 IC5_1.23
  Bottom 0.229: v21.59,7.87 21.59,8.26 22.73,13.21 29.97,13.21 31.5,14.61 v31.5,25.65
COCPU_SCK  (via drill 0.3 pad 0.81, 0.6)
  Top 0.229: IC7_1.12 11.15,9.14 11.15,6.38 12.45,5.08 20.95,5.08 v22.48,6.73 | v33.53,26.04 33.28,26.54 IC5_1.21
  Bottom 0.229: v33.53,26.04 33.53,25.15 33.27,24.89 33.27,13.84 30.73,12.19 25.53,12.06 24.38,10.41 24.13,10.03 23.75,8.89 v22.48,6.73
CSN_NRF  (via drill 0.6)
  Top 0.229: IC5_1.2 37.2,18.69 28.63,18.69 v28.19,19.18
  Bottom 0.229: v28.19,19.18 27.03,19.18 25.86,20.34 25.86,20.75 25.84,20.77 25.84,24.45 21.46,28.83 21.46,33.66 22.61,34.8 24.26,34.8 24.38,34.92 24.38,54.1 25.4,55.24 27.05,55.24 28.37,56.44 NRF24L01.4
DAC_OUT  (via drill 0.6)
  Top 0.229: C2_1.1 4.23,36.58 v1.78,36.58 | IC5_1.20 33.78,28.7 33.27,29.21 v32.89,29.46 | v25.02,30.99 v19.05,30.99
  Bottom 0.229: v32.89,29.46 31.88,30.35 26.29,30.35 25.65,30.99 v25.02,30.99 | v1.78,36.58 3.17,36.58 4.7,35.05 10.67,35.05 14.73,30.99 v19.05,30.99
DRDY_MAG  (via drill 0.6)
  Top 0.229: 30,47.62 IC4_1.11 30.01,47.63 29.75,47.37 29.24,47.37 28.99,47.12 28.99,46.61 28.61,46.23 v28.1,46.23 | IC5_1.26 30.79,32.08 31.75,33.05 31.75,35.18 31.37,35.56 v30.86,35.56
  Bottom 0.229: v28.1,46.23 27.34,46.23 26.32,45.21 26.32,43.31 26.95,42.67 26.95,40.51 26.54,40.13 25.91,39.5 25.91,37.21 27.81,35.31 30.61,35.31 v30.86,35.56
EN_AMP  (via drill 0.6)
  Top 0.229: IC2_1.1 9.78,31.21 v9.78,30.99 | IC5_1.25 31.24,27.65 31.24,30.86 v31.62,31.11 | v27.94,31.11 27.3,31.75 18.03,31.75 17.78,31.5 v17.78,29.21
  Bottom 0.229: v9.78,30.99 12.19,28.57 17.14,28.57 17.65,28.83 v17.78,29.21 | v31.62,31.11 v27.94,31.11
ENABLE_CALC
  Top 0.229: IC7_1.7 8.83,11.05 8.13,11.05 6.6,9.53 6.6,8.76 6.35,8.51 5.84,8.51 5.71,8.38 5.71,7.11 6.65,6.18 T2.1
EXT:1_GPIO  (via drill 0.6)
  Top 0.229: IC5_1.33 25.81,25.65 22.23,25.65 v21.59,25.02 | SV1.2 20.95,4.06 20.95,4.32 23.24,6.35 23.24,12.57 21.97,13.59 21.08,13.59 v20.45,14.61
  Bottom 0.229: v21.59,25.02 19.94,23.24 19.94,15.88 20.45,15.37 v20.45,14.61
EXT:2_GPIO  (via drill 0.6)
  Top 0.229: v22.86,24.13 23.32,23.67 IC5_1.37 | 23.62,1.52 SV1.3 22.35,2.67 22.35,4.83 23.88,6.1 23.88,12.7 22.1,14.22 v21.72,14.61
  Bottom 0.229: v21.72,14.61 21.72,16.51 20.57,17.65 20.57,22.86 21.84,24.13 v22.86,24.13
EXT:3_GPIO  (via drill 0.6)
  Top 0.229: 25.75,23.14 25.77,23.11 IC5_1.38 22.41,23.17 v22.23,22.99 | SV1.4 23.62,5.08 24.38,5.84 24.38,13.46 v23.11,14.73
  Bottom 0.229: v23.11,14.73 23.11,16.13 21.21,18.03 21.21,22.35 21.84,22.99 v22.23,22.99
EXT:4_USB  (via drill 0.6)
  Top 0.229: IC5_1.42 25.78,21.21 24.77,21.21 24.26,21.72 v22.1,21.72 | v24.51,15.11 24.89,14.73 24.89,2.79 26.16,1.52 SV1.5
  Bottom 0.229: v22.1,21.72 22.35,21.46 22.35,18.8 24.51,16.64 v24.51,15.11
EXT:5_USB  (via drill 0.6)
  Top 0.229: IC5_1.44 25.8,20.19 23.62,20.19 23.37,19.94 v23.37,19.43 | SV1.6 25.53,4.57 25.53,13.84 25.78,14.1 v25.78,14.86
  Bottom 0.229: v23.37,19.43 23.37,18.92 25.78,16.51 v25.78,14.86
EXT:6_USB  (via drill 0.6)
  Top 0.229: IC5_1.45 25.81,19.68 25.15,19.68 24.89,19.43 v24.51,19.43 | v26.54,16.38 26.59,16.38 26.59,14.05 26.16,13.61 26.16,5.64 27.38,4.42 27.38,3.38 28.7,2.06 SV1.7
  Bottom 0.229: v24.51,19.43 26.54,17.27 v26.54,16.38
EXT:7_USB  (via drill 0.6)
  Top 0.229: IC5_1.43 25.81,20.65 23.72,20.65 23.44,20.93 v23.44,20.98 | v27.43,14.73 27.43,13.84 26.8,13.21 26.8,5.71 28.57,3.94 SV1.8
  Bottom 0.229: v23.44,20.98 24.11,20.32 25.02,20.32 27.43,17.91 v27.43,14.73
EXT:8_GPIO
  Top 0.229: IC5_1.50 28.32,16.17 28.32,13.59 27.43,12.7 27.43,6.1 27.69,5.84 28.83,5.84 29.97,4.7 29.97,2.79 31.24,1.52 SV1.9
EXT:9_GPIO
  Top 0.229: IC5_1.58 32.26,16.2 32.26,12.45 32.89,11.81 32.89,10.29 31.5,8.89 31.5,5.46 31.24,5.21 SV1.10
EXT:10_GPIO
  Top 0.229: IC5_1.59 32.77,16.21 32.77,12.95 33.33,12.39 33.33,9.8 32.51,8.99 32.51,2.92 33.78,1.65 SV1.11
EXT:11_GPIO
  Top 0.229: IC5_1.61 33.78,12.95 34.04,12.7 34.04,9.27 33.78,9.02 SV1.12
EXT:12_GPIO
  Top 0.229: SV1.13 35.05,2.67 35.05,12.7 34.29,13.46 34.29,16.2 IC5_1.62
EXT:13_GPIO  (via drill 0.6)
  Top 0.229: IC5_1.17 37.59,29.81 v38.23,29.84 | v44.09,13.61 41.91,13.61 41.53,13.34 41.53,9.4 41.02,8.89 37.85,8.89 36.45,7.49 36.45,4.06 SV1.14 | v53.98,26.8 v52.45,29.46
  Bottom 0.229: v44.09,13.61 49.84,13.64 53.98,17.78 v53.98,26.8 | v52.45,29.46 52.45,29.84 v38.23,29.84
EXT:14_GPIO  (via drill 0.6)
  Top 0.229: v55.75,3.17 55.75,1.14 55.24,0.64 41.4,0.64 40.64,1.4 SV1.15 | v55.63,7.75 55.63,17.02 54.1,18.54 v46.61,18.54 | v42.29,25.78 42.18,25.67 IC5_1.16
  Bottom 0.229: v55.75,3.17 55.63,3.3 v55.63,7.75 | v46.61,18.54 45.59,19.56 45.59,24.89 44.7,25.78 v42.29,25.78
EXT:15_GPIO  (via drill 0.6)
  Top 0.229: IC5_1.14 37.2,24.64 36.3,24.64 36.27,26.04 36.45,26.21 36.96,26.21 37.54,26.8 43.18,26.8 43.31,26.67 44.96,26.67 46.86,24.77 v46.86,24.38 | v54.23,3.43 52.32,1.52 47.88,1.52 45.47,3.94 SV1.16 | v49.91,17.27 50.04,17.4 53.34,17.4 54.23,16.51 v54.23,7.75
  Bottom 0.229: v46.86,24.38 46.48,24 46.48,20.7 v49.91,17.27 | v54.23,7.75 v54.23,3.43
GND  (via drill 0.6)
  Top 0.229: C7_2.1 9.38,14.97 IC7_1.36 | IC7_1.36 9.75,14.96 | C7_2.1 5.84,16.22 5.84,16.2 5.54,15.9 5.54,13.26 5.71,13.08 | T2.2 4.76,12.38 5.46,13.08 5.71,13.08 | v16.38,12.45 16.38,13.31 C7_4.1 16.38,13.56 IC7_1.26 15.05,13.59 v18.49,13.59 | C7_2.1 6.11,18.23 IC0_1.5 | C6_1.2 32.58,43.05 IC6_1.3 30.76,43.05 | IC6_1.1 31.54,42.04 31.02,42.04 30.64,42.55 | 30.64,42.55 30.64,42.93 30.76,43.05 | 30.64,42.55 30.05,42.55 29.64,42.05 IC6_1.11 28.81,41.91 27.05,41.91 | C4_1.1 28.57,49.02 IC4_1.8 29.75,49.02 30.01,49.28 IC4_1.6 30.01,50.96 C4_4.1 | IC6_1.8 29.49,43.56 29.75,43.81 29.75,44.96 30,45.21 30.51,45.21 30.76,44.96 30.76,43.05 | v15.24,16.51 14.67,17.08 T4.2 14.67,18.22 15.49,19.05 | C4_2.1 25.39,48.6 24.92,48.13 24.92,43.85 C6_2.2 26.76,42.2 27.05,41.91 | C5_3.1 35.23,14.55 34.8,14.99 34.8,16.2 IC5_1.63 34.78,17.38 | C5_4.1 21.08,17.22 21.08,19.81 | 21.08,19.81 21.62,20.35 C5_2.2 | IC3_1.G3 48.29,37.05 IC3_1.G4 48.49,30.45 48.13,30.1 46.86,30.1 46.74,29.97 45.77,29.97 45.73,30.01 | IC3_1.P6 46.81,29.9 46.99,29.72 46.99,26.73 IC3_1.G1 IC3_1.G2 49.53,26.67 v49.53,27.81 | IC5_1.12 37.9,23.67 38.76,22.8 C5_8.1 C5_7.2 40.75,22.54 U$1.4 42.11,20.9 v42.42,21.21 | v42.42,16.89 41.22,16.89 OSC5_1.2 40.33,16 38.23,16 36.83,17.4 34.8,17.4 34.78,17.38 | 21.08,19.81 21.08,20.11 GND_OUT.1 | 18.24,24.03 19.11,27.57 C5_6.1 23.95,28.9 24.64,29.59 26.43,29.59 C5_1.2 | v49.4,2.54 48.01,2.54 46.74,3.81 46.74,6.73 42.42,11.05 v42.42,12.7 | 27.05,41.91 24.51,39.37 24.51,37.08 23.75,36.32 17.53,36.32 15.27,34.06 15.27,27 | IC5_1.18 34.8,27.64 34.8,28.7 36.27,30.17 C5_5.1 36.87,30.73 40.01,30.73 40.83,29.91 C0_4.2
  Top 0.229: IC7_1.35 IC7_1.36 | IC5_1.60 33.27,17.02 33.63,17.38 34.78,17.38 | IC7_1.5 6.75,12.06 C7_1.1 6.22,12.7 5.84,13.08 5.71,13.08 | C7_3.1 16.13,8.76 15.75,9.14 14.15,9.14 IC7_1.18
  Top 0.254: C0_2.2 7.18,22.07 IC0_1.8 | IC0_1.6 4.89,20.01 IC0_1.TH 5.59,20.26 5.91,19.94
  Top 0.33: IC2_1.7 5.26,32.25 4.95,31.94 4.53,31.94 C2_4.2 3.68,31.09 3.68,28.77 4.64,27.81 | C2_3.1 10.57,29.19 9.72,30.04 7.49,30.04 7.18,29.72 7.18,29.19 C2_2.1 6.96,29.08 6.96,28.87 5.91,27.81 4.64,27.81 | 4.64,27.81 3.94,27.11 3.94,27 | C0_4.2 40.9,29.79
  Top 0.381: T2.2 4.76,5.71 5.4,5.08 7.3,5.08 | 7.3,5.08 7.62,5.08 8.26,5.71 8.26,6.18 T1.2 | C1_1.2 66.87,4.49 IC1_1.1 IC1_1.2 | IC1_1.3 IC1_1.2 | v65.7,7.98 IC1_1.2 | PAD7.1 PAD9.1 PAD8.1 | GND.1 7.3,2.86 7.3,5.08
  Top 0.406: C1_2.2 C1_1.2
  Top 0.508: IC3_1.P6 45.73,30.01 C1_3.1 43.21,29.91 C0_4.2
  Top 1.016: C0_1.1 2.42,26.99 2.49,27.06 2.49,26.95 2.54,27 3.94,27 15.27,27 18.24,24.03 18.24,22.99 GND_OUT.1
  Bottom 0.229: v18.49,13.59 15.62,16.51 v15.24,16.51 16,17.27 16,19.94 18.43,22.37 18.43,22.75 GND_OUT.1 | PAD8.1 57.73,2.29 49.53,2.29 49.53,2.54 v49.4,2.54 | v42.42,12.7 v42.42,16.89 v42.42,21.21 42.42,21.46 40.13,23.75 40.13,27.18 40.77,27.81 v49.53,27.81 | SV1.1 18.41,1.4 16.38,3.43 v16.38,7.37 v16.38,12.45
  Bottom 0.381: PAD7.1 65.06,2.26 65.7,2.9 v65.7,7.98
  pour Top (no thermals): 1.65,20.26 1.65,23.11 3.21,23.11 3.21,24.54 0.51,24.54 0.51,20.26
  pour Top (rank 3, no thermals): 3.52,20.1 3.52,19.3 1.14,19.3 1.14,20.1
  pour Top (no thermals): 4.16,21.05 6.38,21.05 6.38,19.46 3.37,19.46 3.37,20.1 4.16,20.1
  pour Top (isolate 0.305): -0.13,0.25 -0.13,38.38 23.75,38.38 23.75,58.24 35.99,58.24 35.99,38.4 59.87,38.4 59.87,11.23 67.82,11.23 67.82,10.54 67.84,10.54 67.84,0.25
I2S_CK  (via drill 0.6)
  Top 0.229: IC5_1.55 30.73,16.18 30.73,6.35 v30.35,6.1 | v53.21,5.33 56.13,5.33 56.52,5.84 56.52,7.62 57.76,8.87 PAD3.1
  Top 0.381: IC1_1.4 62.9,9.63 PAD1.1 PAD2.1 PAD3.1
  Bottom 0.229: v30.35,6.1 46.99,6.1 47.88,5.33 v53.21,5.33
I2S_SD  (via drill 0.6)
  Top 0.229: IC5_1.57 31.75,16.19 31.75,11.81 v32,11.05 | v56.64,10.54 v56.64,16.51
  Top 0.381: IC1_1.5 63.48,7.98 PAD4.1 PAD5.1 PAD6.1
  Bottom 0.229: PAD6.1 56.52,7.95 56.52,8.76 56.26,9.02 56.26,9.4 56.64,9.78 v56.64,10.54 | v56.64,16.51 51.18,11.05 v32,11.05
INT_GYRO1  (via drill 0.6)
  Top 0.229: IC6_1.4 32.29,43.56 32.54,43.81 32.54,44.83 33.05,45.34 v33.69,45.34 | IC5_1.9 37.21,22.15 35.61,22.15 34.8,21.34 31.5,21.34 v30.73,21.72
  Bottom 0.229: v33.69,45.34 29.37,40.51 29.37,39.21 29.72,38.86 29.72,38.35 32.38,35.69 32.38,33.4 32,33.02 29.08,33.02 28.45,33.66 23.24,33.66 22.86,33.27 22.86,29.34 22.99,29.21 27.05,29.21 27.18,29.08 27.18,22.73 27.56,22.35 29.72,22.35 30.35,21.72 v30.73,21.72
INT_GYRO2  (via drill 0.3 pad 0.05, 0.6)
  Top 0.229: IC6_1.12 v31.27,41.02 | IC5_1.10 37.19,22.71 37.08,22.61 35.31,22.61 35.15,22.45 v34.49,22.45 | v36.45,33.27 36.32,33.15 34.67,33.15 34.16,33.66 v33.15,34.67
  Bottom 0.229: 34.54,22.76 v34.49,22.45 34.49,25.73 34.92,26.16 35.31,26.16 36.7,27.56 36.7,33.27 v36.45,33.27 | v31.27,41.02 31.24,40.99 31.24,37.72 33.15,35.81 v33.15,34.67
INT_MAG  (via drill 0.6)
  Top 0.229: IC4_1.7 29.49,49.53 29.49,50.16 29.11,50.55 28.1,50.55 27.84,50.8 v27.84,51.18 | IC5_1.27 30.3,27.64 30.3,33.05 30.86,33.1 v30.86,34.04
  Bottom 0.229: v27.84,51.18 26.95,50.29 26.95,46.74 25.43,45.21 25.43,43.18 25.43,43.17 25.43,39.83 25.4,39.8 25.4,37.08 27.69,34.67 30.23,34.67 v30.86,34.04
INT_NRF  (via drill 0.6)
  Top 0.229: IC5_1.11 37.17,23.11 36.07,23.11 35.56,23.62 v35.56,23.88 | v37.34,36.32 35.69,37.97 35.69,54.12 33.81,55.99 NRF24L01.8
  Bottom 0.229: v35.56,23.88 35.56,25.65 35.69,25.65 37.34,27.3 v37.34,36.32
INT_XL  (via drill 0.6)
  Top 0.229: IC4_1.12 30.51,46.99 v30.13,46.61 | IC5_1.28 29.84,27.69 29.84,38.35 29.21,38.99 27.05,38.99 26.8,38.48 v26.8,38.1
  Bottom 0.229: v30.13,46.61 28.86,45.34 27.21,45.34 26.83,44.96 26.83,43.81 27.46,43.18 27.46,39.78 26.8,39.24 v26.8,38.1
LINK_RED  (via drill 0.6)
  Top 0.229: IC7_1.20 18.52,10.56 v19.3,9.78 | v17.53,4.32 13.46,4.32 12.45,3.3 12.45,1.33 LINK_RED.1
  Bottom 0.229: v19.3,9.78 19.3,8.26 17.91,6.86 17.91,4.7 v17.53,4.32
LINK_WHITE  (via drill 0.6)
  Top 0.229: LINK_WHITE.1 16.89,1.27 v19.05,3.43 | v20.19,11.05 15.04,11.05 IC7_1.21
  Bottom 0.229: v19.05,3.43 19.05,4.83 19.43,5.21 19.43,6.6 20.19,7.37 v20.19,11.05
MEMS_SCL  (via drill 0.6)
  Top 0.229: IC4_1.1 31.02,48.01 31.02,46.1 | 31.02,46.1 30.64,45.72 29.65,45.72 | 29.65,45.72 29.62,45.72 28.96,45.05 IC6_1.7 28.96,45.03 29.65,45.72 | 31.02,46.1 31.65,46.74 v32.67,46.74 | IC5_1.29 29.34,27.68 29.34,37.72 v28.7,37.97
  Bottom 0.229: v32.67,46.74 32.67,45.47 31.02,43.81 29.24,43.81 28.61,43.18 28.61,38.45 v28.7,37.97
MEMS_SDA  (via drill 0.6)
  Top 0.229: IC4_1.4 v31.78,49.53 | IC6_1.9 28.35,43.05 27.97,43.43 v27.84,44.45 | v28.32,36.3 28.32,35.31 28.83,34.8 28.83,27.67 IC5_1.30
  Bottom 0.229: v31.78,49.53 31.78,45.97 30.26,44.45 v27.84,44.45 27.94,44.45 27.94,43.69 27.97,40.26 27.96,40.25 27.96,39.45 27.66,39.14 27.66,37.62 28.32,36.96 v28.32,36.3
N$1
  Top 0.33: R2_2.2 10.88,34.7 10.35,34.16 10.35,33.21 10.03,32.89 IC2_1.3
N$2
  Top 0.33: IC2_1.4 9.39,34.47 10.03,35.12 10.03,36.28 R2_1.2
N$3
  Top 0.33: R2_1.1 C2_1.2
N$4
  Top 0.33: R2_2.1 11.84,32.99 12.89,31.94 12.89,28.45 12.57,28.13 9.93,28.13 C2_2.2
N$5
  Top 0.33: IC2_1.2 10.36,32.25 10.67,31.94 10.67,31.84 C2_3.2
N$6
  Top 0.229: U$1.1 38.96,20.67 IC5_1.6
N$7
  Top 0.229: IC4_1.5 30.51,50.42 31.11,51.02 C4_4.2
N$8
  Top 0.229: IC5_1.13 37.24,24.18 38.18,24.18 38.35,24.36 C5_8.2 C5_7.1 FERRITE.2
N$9  (via drill 0.6)
  Top 0.229: IC7_1.25 15.03,11.64 15.11,11.56 COCPU_SWDIO.TP
  other vias: 17.78,11.81
N$10
  Top 0.254: IC0_1.9 5.39,22.28 5.91,22.8 5.91,23.75 6.22,24.07 7.07,24.07 C0_2.1
N$11
  Top 0.33: IC2_1.5 6.24,33.83 5.59,34.48 2.73,34.48 SPEAKER+.1
N$12
  Top 0.229: C5_2.1 22.14,18.67 IC5_1.47
N$13
  Top 0.229: C5_1.1 28.28,29.5 IC5_1.31
N$14
  Top 0.33: SPEAKER-.1 5.27,30.64 IC2_1.8
N$15
  pour Top (no thermals): 4.95,19.15 4.95,15.65 3.84,15.65 3.84,19.15
N$16
  Top 0.381: R3.2 3.07,6.28 T3.1 3.17,5.4 4.13,4.45 5.25,4.45 T2.3
N$17  (via drill 0.6)
  Top 0.229: IC7_1.4 7.37,12.56 7.11,12.83 7.11,13.46 COCPU_NRST.TP
  other vias: 6.35,14.22
N$18
  Top 0.229: T4.3 VIBRATE.1
N$19  (via drill 0.6)
  Top 0.229: IC7_1.28 14.13,16.22 COCPU_SWCLK.TP
  other vias: 13.84,16.51
N$20  (via drill 0.6)
  Top 0.229: IC5_1.49 27.78,16.8 27.56,17.02 27.56,18.41 27.43,18.54 27.43,19.81 27.56,19.94 28.32,19.94 28.7,20.32 28.7,20.7 MAINCPU_SWCLK.TP
  other vias: 29.08,21.08
N$21  (via drill 0.6)
  Top 0.229: MAINCPU_SWDIO.TP 27.69,20.83 26.92,20.07 26.92,19.3 26.8,19.18 IC5_1.46
  other vias: 27.69,21.08
N$22  (via drill 0.6)
  Top 0.229: OSC5_1.3 38.73,13.17 v38.73,13.46 | v38.73,18.03 38.35,18.29 38.35,19.05 38.24,19.17 IC5_1.3
  Bottom 0.229: v38.73,13.46 v38.73,18.03
N$23  (via drill 0.6)
  Top 0.229: IC5_1.7 35.52,21.17 MAINCPU_NRST.TP
  other vias: 34.92,20.57
N$24
  Top 0.229: R1.2 9.27,19.39 R2.1 10.5,18.16 11.18,18.16 11.68,17.65 11.68,16.64 12.63,15.69 IC7_1.31
N$25
  Top 0.229: IC7_1.32 12.13,15.56 11.81,15.88 11.09,15.88 R2.2
NRF_MISO  (via drill 0.6)
  Top 0.229: IC5_1.35 25.86,24.64 v29.08,24.64 | v34.8,37.34 35.05,37.59 35.05,51.74 33.81,52.98 NRF24L01.7
  Bottom 0.229: v29.08,24.64 29.08,25.65 31.37,27.94 33.66,27.94 34.54,28.83 34.54,33.78 34.8,34.04 v34.8,37.34
NRF_MOSI  (via drill 0.6)
  Top 0.229: IC5_1.36 25.86,24.13 27.18,24.13 27.81,23.5 v28.7,23.5
  Bottom 0.229: v28.7,23.5 29.59,23.5 30.35,24.26 30.35,26.04 31.62,27.3 34.29,27.3 35.43,28.45 35.43,33.91 35.69,34.16 35.69,54.23 34.67,55.24 32.51,55.24 31.32,56.44 NRF24L01.6
NRF_SCK  (via drill 0.6)
  Top 0.229: IC5_1.34 25.85,25.15 27.05,25.15 27.69,25.78 v28.19,25.78
  Bottom 0.229: v28.19,25.78 30.99,28.57 33.4,28.57 33.91,29.08 33.91,38.99 35.05,40.13 35.05,51.94 34.29,52.7 33.15,52.7 31.95,53.9 NRF24L01.5
ON_KEY
  Top 0.229: IC7_1.9 8.82,9.65 8.64,9.65 8.26,9.27 8.26,7.11 8.51,6.86 9.02,6.86 9.27,6.6 9.27,4.83 9.53,4.57 9.91,4.57 10.16,4.32 ON_KEY.1
SD_DET
  Top 0.229: IC3_1.G5 51.56,35.13 51.56,24.51 47.24,20.19 40.26,20.19 40.01,20.45 40.01,21.46 39.8,21.67 IC5_1.8
SDIO_CK  (via drill 0.6)
  Top 0.229: IC5_1.53 29.72,16.16 29.72,9.02 v29.34,8.51 | IC3_1.P5 45.95,30.99 v47.62,30.99 | v52.32,30.99 58.04,25.27 v58.04,25.15
  Bottom 0.229: v47.62,30.99 v52.32,30.99 | v58.04,25.15 58.8,24.38 58.8,13.72 57.53,12.45 55.75,12.45 51.82,8.51 v29.34,8.51
SDIO_CMD  (via drill 0.6)
  Top 0.229: IC5_1.54 30.23,16.17 30.23,7.75 v29.84,7.24 | IC3_1.P3 46.04,33.4 v47.37,33.4
  Bottom 0.229: v47.37,33.4 58.55,33.4 59.18,32.77 59.18,30.86 59.18,30.61 59.18,25.35 59.38,25.15 59.38,12.78 58.29,11.68 56.01,11.68 51.56,7.24 v29.84,7.24
SDIO_D0
  Top 0.229: IC5_1.39 25.89,22.73 29.46,22.73 30.48,23.75 33.66,23.75 33.91,24 33.91,25.02 34.16,25.27 34.42,25.27 34.42,26.04 34.67,26.29 35.18,26.29 37.72,28.83 45.81,28.83 IC3_1.P7
SDIO_D1
  Top 0.229: 45.6,27.94 IC3_1.P8 43.8,27.7 43.31,28.19 37.72,28.19 35.31,25.78 35.05,25.78 34.92,25.65 34.92,25.02 34.54,24.64 34.54,23.88 33.91,23.24 30.86,23.24 29.79,22.17 IC5_1.40
SDIO_D2  (via drill 0.6)
  Top 0.229: IC5_1.51 28.83,16.16 28.83,12.7 28.07,11.94 28.07,7.11 v28.32,7.24 | IC3_1.P1 46.12,35.69 v47.24,35.69 | v55.63,35.56 56.13,35.05 v56.13,32.13
  Bottom 0.229: v28.32,7.24 28.07,7.11 28.07,10.54 28.19,10.67 30.1,10.67 30.73,10.03 51.31,10.03 55.24,13.97 56.77,13.97 57.53,14.73 57.53,21.59 56.13,22.99 v56.13,32.13 | v47.24,35.69 47.37,35.56 v55.63,35.56
SDIO_D3  (via drill 0.6)
  Top 0.229: IC5_1.52 29.34,16.16 29.34,10.03 29.08,9.78 v28.83,9.78 | IC3_1.P2 46.08,34.54 v47.12,34.54 | v57.15,34.54 57.91,33.78 v57.91,32
  Bottom 0.229: v28.83,9.78 29.21,9.4 51.69,9.4 55.24,12.95 57.02,12.95 58.17,14.1 58.17,22.1 56.9,23.37 56.9,29.97 57.91,30.99 v57.91,32 | v47.12,34.54 v57.15,34.54
SHORT_BACKUPBATT  (via drill 0.6)
  Top 0.229: IC7_1.8 8.82,10.54 8.26,10.54 7.75,10.03 7.75,8.51 v6.99,7.75 | v11.18,4.32 11.56,4.06 11.18,4.83 10.16,5.72 T1.1
  Bottom 0.229: v6.99,7.75 11.56,4.57 v11.18,4.32
VBACKUPBATT  (via drill 0.6)
  Top 0.229: T1.3 9.02,3.28 9.02,3.05 8,2.03 8,1.27 | v28.32,17.78 28.71,18.17 IC5_1.1
  Top 0.381: T1.3 8.89,3.66 8.89,2.86 7.94,1.91 VBACKUPBATT.1
  Bottom 0.229: VBACKUPBATT.1 7.94,1.59 9.27,2.92 12.32,2.92 12.83,3.43 12.83,4.7 11.56,5.97 11.56,9.91 15.75,14.1 17.02,14.1 17.65,13.46 17.65,12.83 17.78,12.7 19.81,12.7 20.83,13.72 27.94,13.72 28.32,14.1 v28.32,17.78
VCALC
  Top 0.381: T3.3 3.49,2.71 VCALC.1
VIBRATE
  Top 0.229: IC7_1.29 13.64,14.98 13.59,15.03 13.59,15.62 13.46,15.75 13.21,15.75 13.02,16.06 T4.1 12.77,17.71
VMAINBATT  (via drill 0.6)
  Top 0.229: R1.1 10.12,21.68 MAINBATT_OUT.1
  Top 0.254: IC0_1.13 IC0_1.12
  Top 1.016: VMAINBATT.1 0.76,1.78 0.76,5.59 1.27,6.1 T3.2 1.37,6.28 R3.1 1.27,8.36 1.27,11.05 1.52,11.3 v2.41,11.3 | C0_1.2 4.44,23.87 v4.45,25.53 8.89,25.53 MAINBATT_OUT.1
  Bottom 1.016: v2.41,11.3 4.45,13.34 v4.45,25.53
  pour Top (no thermals): 4.95,21.53 3.84,21.53 3.84,23.75 4.95,23.75